# Altium schematic sheet 8-LEDx4.SchDoc
size A4
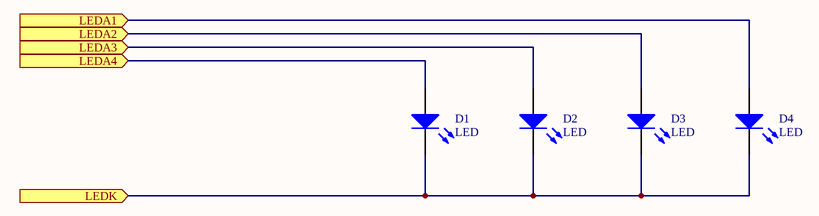
[diagram p0: 8-LEDx4.SchDoc]

## Parts
D1  LED  [LED-0]
D2  LED  [LED-0]
D3  LED  [LED-0]
D4  LED  [LED-0]

## Ports
LEDA1 (in), LEDA2 (in), LEDA3 (in), LEDA4 (in), LEDK (in)

## Nets
LEDA1: D4.1(A) ; port LEDA1
LEDA2: D3.1(A) ; port LEDA2
LEDA3: D2.1(A) ; port LEDA3
LEDA4: D1.1(A) ; port LEDA4
LEDK: D1.2(K) D2.2(K) D3.2(K) D4.2(K) ; port LEDK

## Library data of the parts
D1-D4 = LED0: Diffused Green 3mm LED; Published: 8-Jun-2000; LatestRevisionDate: 08-Jul-2005; LatestRevisionNote: Mech Layer 1 removed.; PackageReference: LED-0; Publisher: Altium Limited; PackageDescription: LED; 2 Leads